# EAGLE design Weather Station For Drones - MKR1000 (EAGLE 7.5.0)
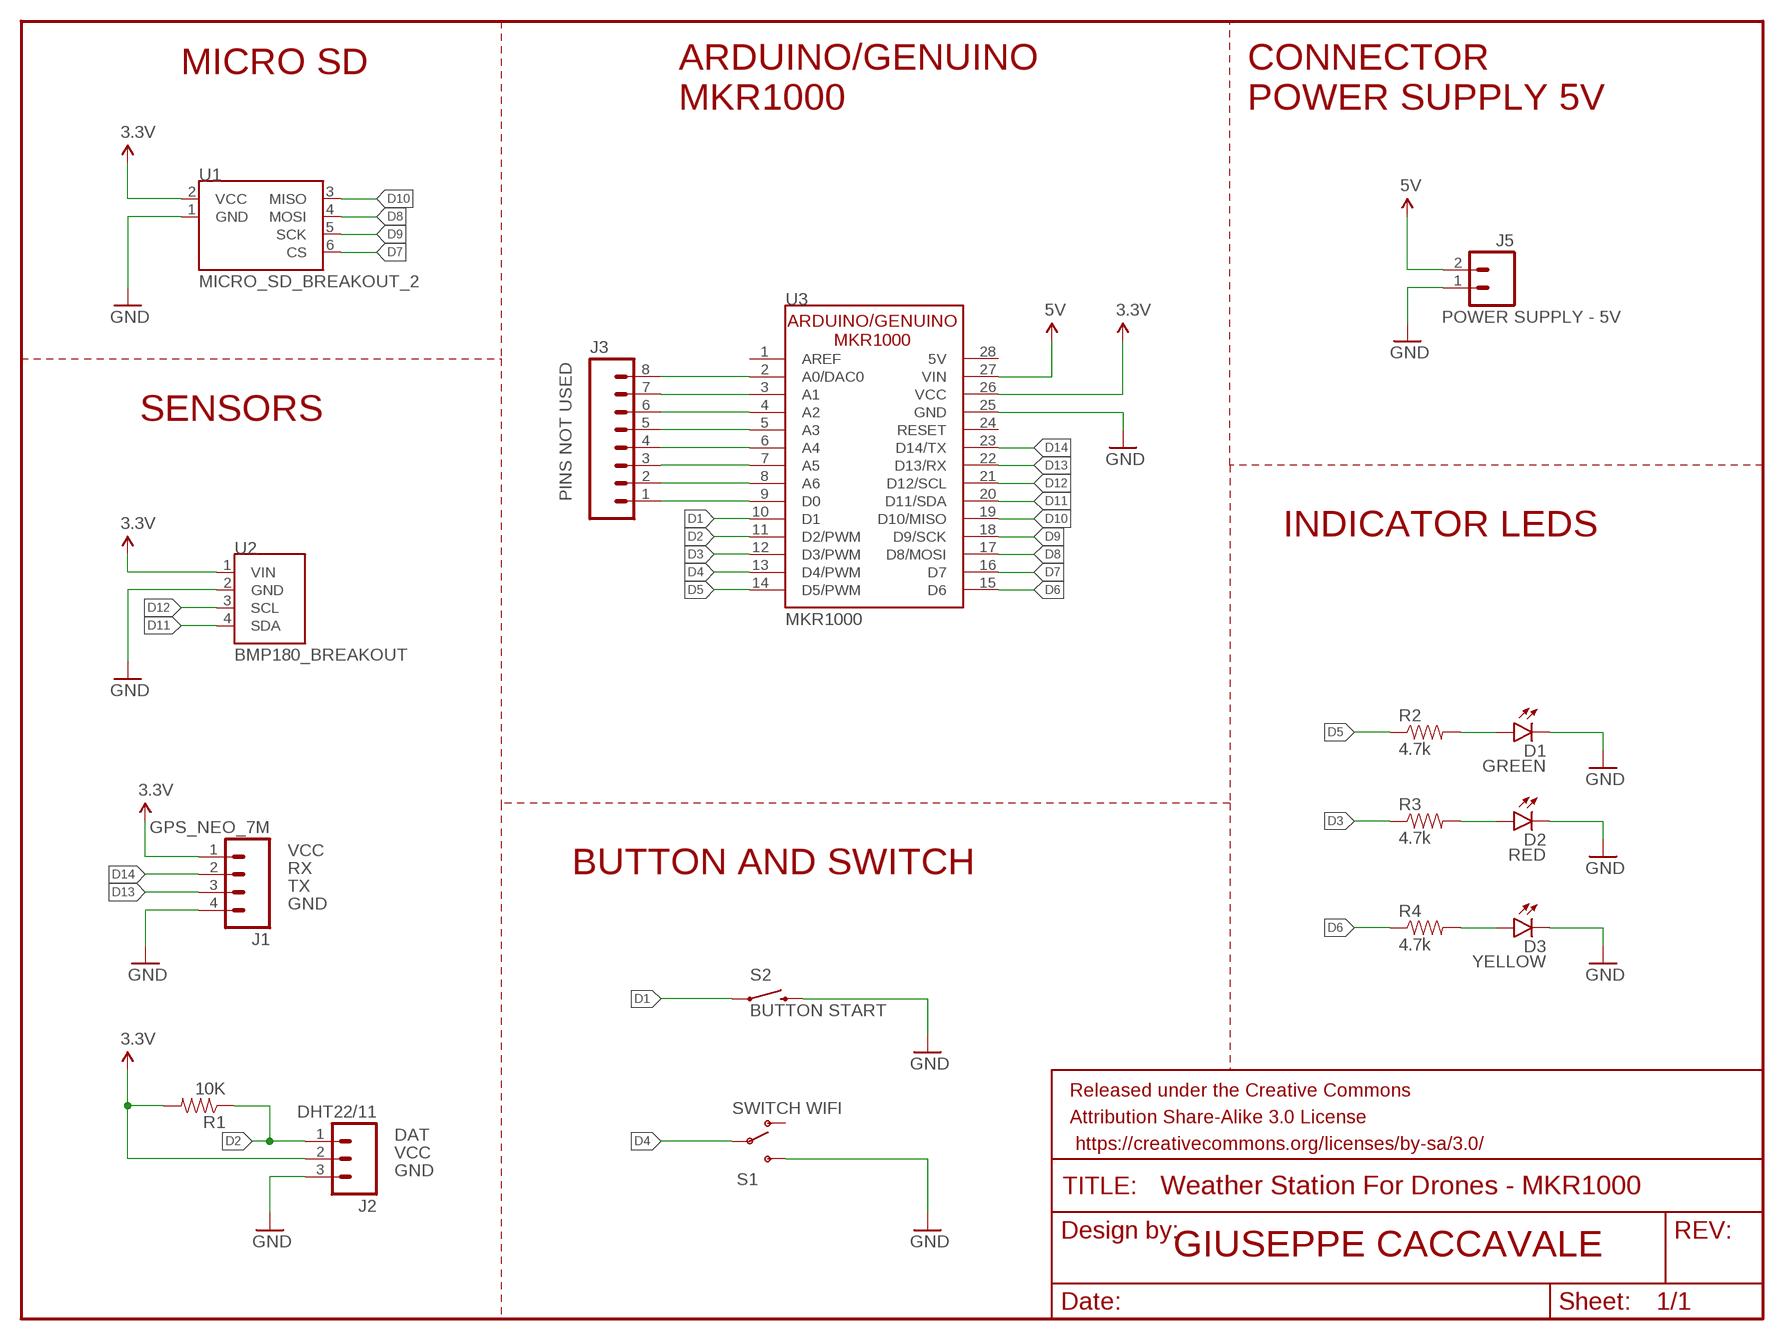
[diagram p0: schematic, sheet 1]

## Parts
D1  GREEN  LED3MM  [LED3MM]
D2  RED  LED3MM  [LED3MM]
D3  YELLOW  LED3MM  [LED3MM]
FRAME1  FRAME-LETTER  [CREATIVE_COMMONS]
J1  GPS_NEO_7M  M04LONGPADS  [1X04_LONGPADS]
J2  DHT22/11  M03LONGPADS  [1X03_LONGPADS]
J3  PINS NOT USED  M08LONGPADS  [1X08_LONGPADS]
J5  POWER SUPPLY - 5V  M02JST-PTH-2  [JST-2-PTH]
R1  10K  RESISTORAXIAL-0.3  [AXIAL-0.3]
R2  4.7k  RESISTORAXIAL-0.3  [AXIAL-0.3]
R3  4.7k  RESISTORAXIAL-0.3  [AXIAL-0.3]
R4  4.7k  RESISTORAXIAL-0.3  [AXIAL-0.3]
S1  SWITCH WIFI  SWITCH-SPDTKIT  [SWITCH-SPDT_KIT]
S2  BUTTON START  SWITCH-MOMENTARY-2PTH  [TACTILE-PTH]
U1  MICRO_SD_BREAKOUT_2  [MICRO_SD_ONLY_PIN]
U2  BMP180_BREAKOUT  [BMP180_BREAKOUT]
U3  MKR1000  [MKR1000]

## Nets
3.3V: J1.1 J2.2 R1.P$2 U1.2(VCC) U2.1(VIN) U3.26(VCC)
5V: J5.2 U3.27(VIN)
D1: S2.1 S2.2 U3.10(D1)
D2: J2.1 R1.P$1 U3.11(D2/PWM)
D3: R3.P$1 U3.12(D3/PWM)
D4: S1.2(P) U3.13(D4/PWM)
D5: R2.P$1 U3.14(D5/PWM)
D6: R4.P$1 U3.15(D6)
D7: U1.6(CS) U3.16(D7)
D8: U1.4(MOSI) U3.17(D8/MOSI)
D9: U1.5(SCK) U3.18(D9/SCK)
D10: U1.3(MISO) U3.19(D10/MISO)
D11: U2.4(SDA) U3.20(D11/SDA)
D12: U2.3(SCL) U3.21(D12/SCL)
D13: J1.3 U3.22(D13/RX)
D14: J1.2 U3.23(D14/TX)
GND: D1.K(C) D2.K(C) D3.K(C) J1.4 J2.3 J5.1 S1.3(S) S2.3 S2.4 U1.1(GND) U2.2(GND) U3.25(GND)
N$1: D1.A R2.P$2
N$2: D2.A R3.P$2
N$3: J3.1 U3.9(D0)
N$4: J3.2 U3.8(A6)
N$5: J3.3 U3.7(A5)
N$6: J3.4 U3.6(A4)
N$7: J3.5 U3.5(A3)
N$8: J3.6 U3.4(A2)
N$9: J3.7 U3.3(A1)
N$10: J3.8 U3.2(A0/DAC0)
N$12: D3.A R4.P$2
Unconnected: S1.1(O) U3.1(AREF) U3.24(RESET) U3.28(5V)

## Notes on the sheet
- MICRO SD
- ARDUINO/GENUINO
  MKR1000
- CONNECTOR
  POWER SUPPLY 5V
- SENSORS
- INDICATOR LEDS
- VCC
- RX | BUTTON AND SWITCH
- TX
- GND
- DAT
- VCC
- GND
- GIUSEPPE CACCAVALE

## Library data of the parts
D1-D3 = SparkFun-LED:LED: LEDs Standard schematic elements and footprints for 5mm, 3mm, 1206, and 0603 sized LEDs. 5mm - Spark Fun Electronics SKU : COM-00529 (and others); PROD_ID: DIO-08794
FRAME1 = SparkFun-Retired:FRAME-LETTER: Schematic Frame Standard 8.5x11 US Letter frame
J1 = SparkFun-Connectors:M04: Header 4 Standard 4-pin 0.1" header. Use with straight break away headers (SKU : PRT-00116), right angle break away headers (PRT-00553), swiss pins (PRT-00743), machine pins (PRT-00117), and female headers (PRT-00115). Molex polarized connector foot print use with SKU : PRT-08231 with associated crimp pins and housings. 1MM SMD Version SKU: PRT-10208; PROD_ID: CONN-09696
J2 = SparkFun-Connectors:M03: Header 3 Standard 3-pin 0.1" header. Use with straight break away headers (SKU : PRT-00116), right angle break away headers (PRT-00553), swiss pins (PRT-00743), machine pins (PRT-00117), and female headers (PRT-00115). Molex polarized connector foot print use with SKU : PRT-08232 with associated crimp pins and housings.
J3 = SparkFun-Connectors:M08: Header 8 Standard 8-pin 0.1" header. Use with straight break away headers (SKU : PRT-00116), right angle break away headers (PRT-00553), swiss pins (PRT-00743), machine pins (PRT-00117), and female headers (PRT-00115).
J5 = SparkFun-Connectors:M02: Standard 2-pin 0.1" header. Use with - straight break away headers ( PRT-00116) - right angle break away headers (PRT-00553) - swiss pins (PRT-00743) - machine pins (PRT-00117) - female headers (PRT-00115) Molex polarized connector foot print use with: PRT-08233 with associated crimp pins and housings. 2.54_SCREWTERM for use with PRT-10571. 3.5mm Screw Terminal footprints for PRT-08084 5mm Screw Terminal footprints for use with PRT-08432; PROD_ID: CONN-09863; SKU: PRT-09914
R1-R4 = SparkFun-Passives:RESISTOR: Resistor Basic schematic elements and footprints for 0603, 1206, and PTH resistors.
S1 = SparkFun-Electromechanical:SWITCH-SPDT: SPDT Switch Simple slide switch, Spark Fun Electronics SKU : COM-00102 DPDT SMT slide switch, AYZ0202, SWCH-08179; PROD_ID: SWCH-08261
S2 = SparkFun-Electromechanical:SWITCH-MOMENTARY-2: Various NO switches- pushbuttons, reed, etc; PROD_ID: SWCH-08441
U1 = GClib:MICRO_SD_BREAKOUT
U2 = GClib:BMP180_BREAKOUT
U3 = GClib:MKR1000: ARDUINO/GENUINO MKR1000

## Board
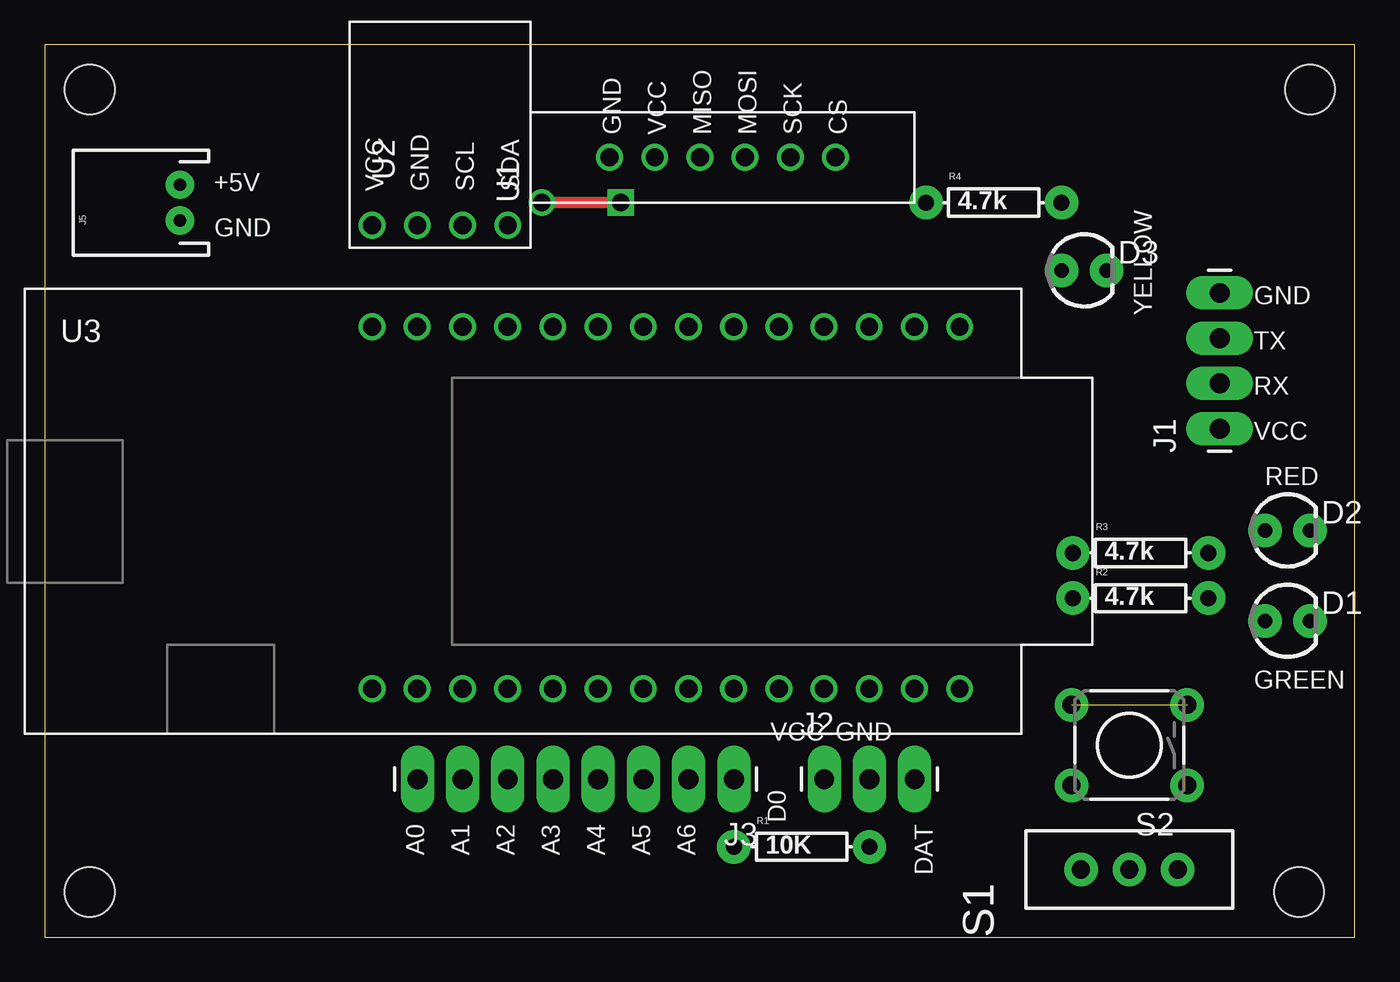
[diagram p1: board, top side]
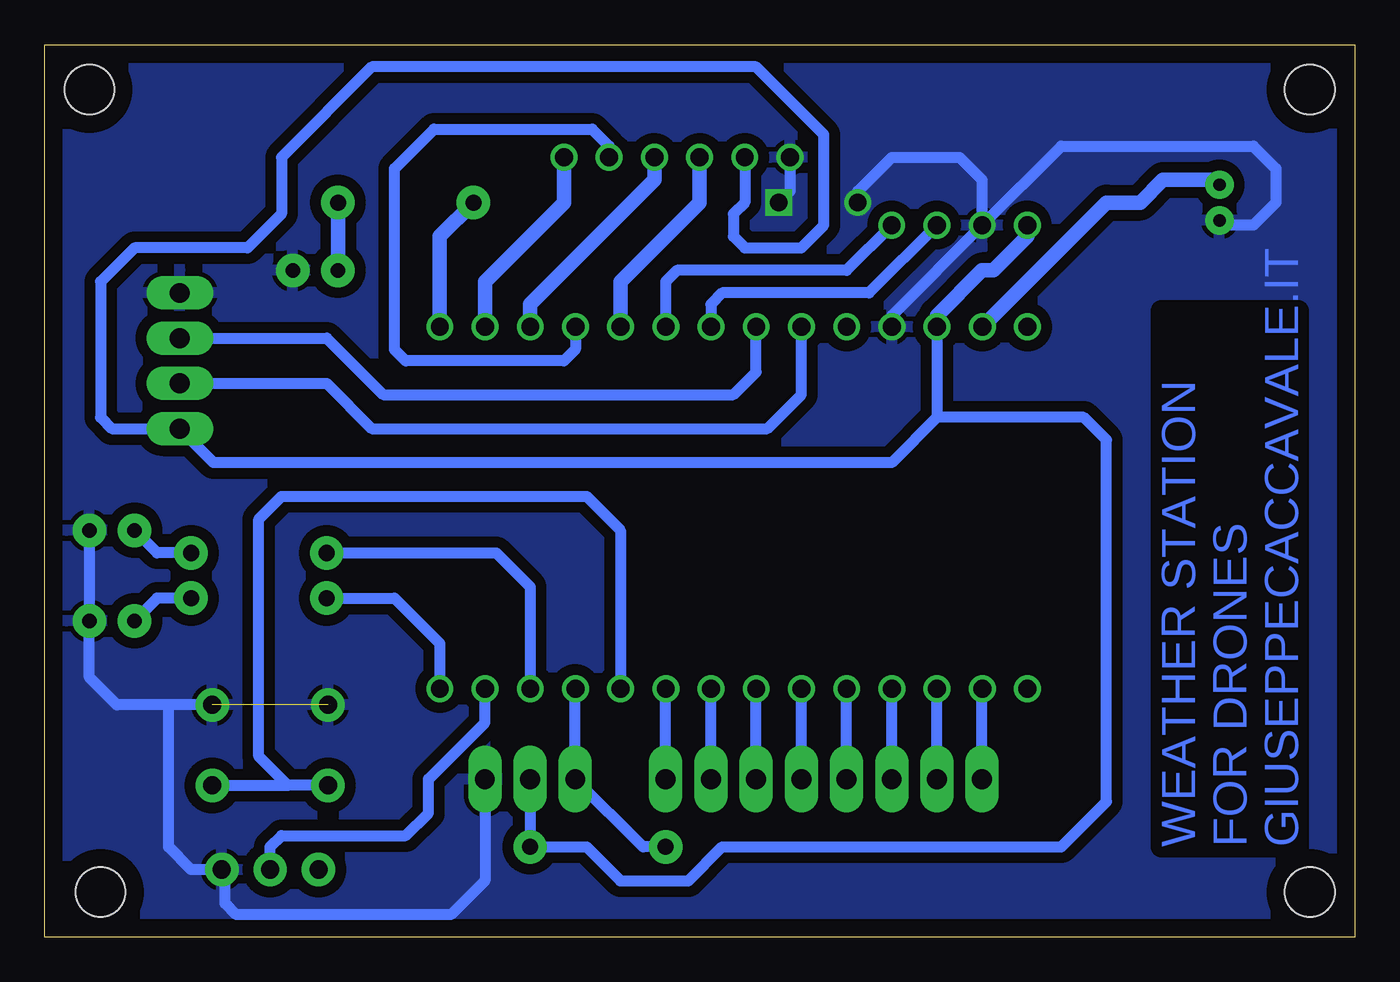
[diagram p2: board, bottom side, seen from below]

Size 73.64 x 50.15 mm. Coordinates in mm from the lower left corner, seen from the top.
Outline: 0,0 73.64,0 73.64,50.15 0,50.15 0,0
Copper layers (1*16): Top 0.035mm / dielectric 1.5mm / Bottom 0.035mm
Design rules "default": minimum track width 10mil, minimum drill 24mil, track to track 8mil, track to pad 8mil, pad to pad 8mil, via to via 8mil, smd to smd 8mil, copper to edge 40mil, drill to drill 8mil, minimum pad ring 10mil, minimum via ring 8mil, stop-mask expansion 4mil, vias tented up to drill 0mil, thermal gap 10mil
Holes 2.8 mm at 2.54,47.62 71.12,47.62 70.48,2.54 2.54,2.54

### Footprints (pad centres in the part's own frame; a part is rotated, then mirrored left to right if it is on the bottom)
LED3MM = drill 0.813 pad 1.88: A -1.27,0; K 1.27,0
1X04_LONGPADS = drill 1.118 pad 1.88 long: 1 0,0; 2 2.54,0; 3 5.08,0; 4 7.62,0
1X03_LONGPADS = drill 1.118 pad 1.88 long: 1 0,0; 2 2.54,0; 3 5.08,0
1X08_LONGPADS = drill 1.118 pad 1.88 long: 1 0,0; 2 2.54,0; 3 5.08,0; 4 7.62,0; 5 10.16,0; 6 12.7,0; 7 15.24,0; 8 17.78,0
JST-2-PTH = drill 0.7 pad 1.6: 1 -1,0; 2 1,0
AXIAL-0.3 = drill 0.9 pad 1.88: P$1 -3.81,0; P$2 3.81,0
SWITCH-SPDT_KIT = drill 1.016 pad 1.88: 1 0,2.718; 2 0,0; 3 0,-2.718
TACTILE-PTH = drill 1.016 pad 1.88: 1 -3.251,2.261; 2 3.251,2.261; 3 -3.251,-2.261; 4 3.251,-2.261
MICRO_SD_ONLY_PIN = drill 1: 1 0,12.7; 2 0,10.16; 3 0,7.62; 4 0,5.08; 5 0,2.54; 6 0,0
BMP180_BREAKOUT = drill 1: 1 -5.08,3.81; 2 -5.08,1.27; 3 -5.08,-1.27; 4 -5.08,-3.81
MKR1000 = drill 1: 1 19.51,2.54; 2 22.05,2.54; 3 24.59,2.54; 4 27.13,2.54; 5 29.67,2.54; 6 32.21,2.54; 7 34.75,2.54; 8 37.29,2.54; 9 39.83,2.54; 10 42.37,2.54; 11 44.91,2.54; 12 47.45,2.54; 13 49.99,2.54; 14 52.53,2.54; 15 52.53,22.86; 16 49.99,22.86; 17 47.45,22.86; 18 44.91,22.86; 19 42.37,22.86; 20 39.83,22.86; 21 37.29,22.86; 22 34.75,22.86; 23 32.21,22.86; 24 29.67,22.86; 25 27.13,22.86; 26 24.59,22.86; 27 22.05,22.86; 28 19.51,22.86

### Placement (x,y rotation side)
D1  69.85,17.78 0 top
D2  69.85,22.86 0 top
D3  58.42,37.47 0 top
FRAME1  18.41,-8.26 0 top  (outside the outline)
J1  66.04,28.57 90 top
J2  43.81,8.89 0 top
J3  38.73,8.89 180 top
J5  7.62,41.27 90 top
R1  42.55,5.08 0 top
R2  61.59,19.05 0 top
R3  61.59,21.59 0 top
R4  53.34,41.27 0 top
S1  60.96,3.81 90 top
S2  60.96,10.79 180 top
U1  44.45,43.81 90 top
U2  22.23,45.09 90 top
U3  -1.1,11.43 0 top

### Tracks (layer width: path | path; a pad name or v marks a point on that pad's centre or on a via)
3.3V
  Bottom 0.61: J2.2 R1.P$2 43.18,5.08 41.27,3.17 37.47,3.17 35.56,5.08 16.51,5.08 13.97,7.62 13.97,27.94 15.24,29.21 23.5,29.21 | 23.5,34.92 23.5,29.21 | 23.5,29.21 26.04,26.67 64.14,26.67 J1.1 69.85,28.57 70.48,29.21 70.48,36.83 68.58,38.73 62.23,38.73 60.33,40.64 60.33,43.81 55.24,48.9 33.66,48.9 29.84,45.09 29.84,40.01 31.11,38.73 34.29,38.73 34.92,39.37 34.92,40.64 34.29,41.27 U1.2
  Bottom 0.813: U2.1 18.41,39.37 20.32,37.47 20.95,37.47 23.5,34.92 23.5,34.3 U3.26
5V
  Bottom 0.813: U3.27 13.97,41.27 12.06,41.27 10.79,42.55 7.89,42.55 J5.2
D1
  Bottom 0.61: S2.2 59.97,8.53 | 59.97,8.53 61.59,10.16 61.59,23.5 60.33,24.77 43.18,24.77 41.27,22.86 U3.10 | S2.1 59.97,8.53
D2
  Bottom 0.61: U3.11 43.81,13.96 J2.1 40.01,5.08 R1.P$1
D3
  Bottom 0.61: R3.P$1 48.26,21.59 46.35,19.68 U3.12
D4
  Bottom 0.61: S1.2 60.96,5.08 60.33,5.71 53.34,5.71 52.07,6.99 52.07,8.89 48.9,12.06 U3.13
D5
  Bottom 0.61: R2.P$1 53.98,19.05 51.44,16.51 U3.14
D6
  Bottom 0.813: U3.15 51.42,39.38 R4.P$1
D7
  Bottom 0.813: U1.6 44.45,41.27 48.9,36.83 U3.16
D8
  Bottom 0.61: 46.35,34.92 U3.17
  Bottom 0.813: U1.4 39.37,42.55 46.35,35.56 46.35,34.92
D9
  Bottom 0.61: U3.18 43.8,33.03 44.45,32.38 53.34,32.38 53.98,33.02 53.98,43.18 51.75,45.4 42.86,45.4 41.91,44.45 U1.5
D10
  Bottom 0.813: U1.3 36.83,41.27 41.27,36.83 U3.19
D11
  Bottom 0.61: U2.4 28.57,37.47 38.1,37.47 38.73,36.83 U3.20
D12
  Bottom 0.61: U2.3 27.3,36.2 35.56,36.2 36.2,35.56 U3.21
D13
  Bottom 0.61: J1.3 57.78,33.66 54.61,30.48 34.92,30.48 33.66,31.75 U3.22
D14
  Bottom 0.61: J1.2 57.78,31.11 55.24,28.57 33.02,28.57 31.11,30.48 U3.23
GND  (via drill 1)  (1 unrouted)
  Top 0.61: v32.38,41.27 v27.94,41.27
  Bottom 0.61: D2.K D1.K 71.12,14.61 69.57,13.06 66.67,13.06 | S2.3 66.67,13.06 | U2.2 26.04,34.92 26.04,34.3 U3.25 | J2.3 48.9,3.17 50.8,1.27 62.87,1.27 63.5,1.91 63.5,3.63 S1.3 65.41,3.81 66.67,5.08 66.67,13.06 | U2.2 16.51,44.45 5.71,44.45 4.45,43.18 4.45,41.27 5.71,40.01 7.35,40.01 J5.1 | U1.1 31.75,41.91 v32.38,41.27 | v27.94,41.27 27.94,41.91 26.04,43.81 22.23,43.81 20.95,42.55 U2.2
  pour Bottom (isolate 0.61): 0,50.16 0,0 73.66,0 73.66,50.16
N$1
  Bottom 0.61: R2.P$2 67.31,19.05 D1.A
N$2
  Bottom 0.61: R3.P$2 67.31,21.59 D2.A
N$3
  Bottom 0.61: J3.1 U3.9
N$4
  Bottom 0.61: J3.2 U3.8
N$5
  Bottom 0.61: J3.3 U3.7
N$6
  Bottom 0.61: J3.4 U3.6
N$7
  Bottom 0.61: J3.5 U3.5
N$8
  Bottom 0.61: J3.6 26.04,13.96 U3.4
N$9
  Bottom 0.61: J3.7 23.5,13.96 U3.3
N$10
  Bottom 0.61: J3.8 U3.2
N$12
  Bottom 0.813: R4.P$2 D3.A

### Text on the board
Bottom: WEATHER STATION / FOR DRONES / GIUSEPPECACCAVALE.IT
tPlace: GND | VCC | MISO | MOSI | SCK | CS | +5V | VCC | GND | SCL | SDA | GND | GND | YELLOW | TX | RX | VCC | RED | GREEN | VCC | GND | D0 | A0 | A1 | A2 | A3 | A4 | A5 | A6 | DAT